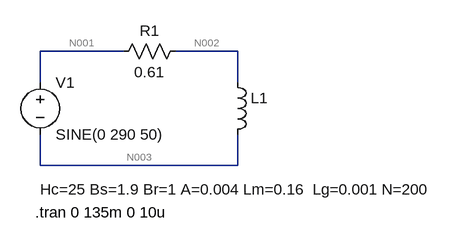
[diagram p0: schematic Inductor with a magnetic core.asc]
Inductor with a magnetic core.asc, the LTspice schematic file:
Version 4.1
SHEET 1 880 680
WIRE 224 16 96 16
WIRE 400 16 304 16
WIRE 96 64 96 16
WIRE 400 64 400 16
WIRE 96 192 96 144
WIRE 400 192 400 144
WIRE 400 192 96 192
SYMBOL voltage 96 48 R0
WINDOW 123 0 0 Left 0
WINDOW 39 0 0 Left 0
SYMATTR InstName V1
SYMATTR Value SINE(0 290 50)
SYMBOL res 320 0 R90
WINDOW 0 0 56 VBottom 2
WINDOW 3 32 56 VTop 2
SYMATTR InstName R1
SYMATTR Value 0.61
SYMBOL ind 384 48 R0
WINDOW 3 -288 181 Left 2
SYMATTR Value Hc=25 Bs=1.9 Br=1 A=0.004 Lm=0.16  Lg=0.001 N=200
SYMATTR InstName L1
SYMATTR SpiceLine Rser=1m
TEXT 88 264 Left 2 !.tran 0 135m 0 10u

The netlist it stands for:
* Inductor with a magnetic core.asc
V1 N001 N003 SINE(0 290 50)
R1 N002 N001 0.61
L1 N002 N003 Hc=25 Bs=1.9 Br=1 A=0.004 Lm=0.16  Lg=0.001 N=200 Rser=1m
.tran 0 135m 0 10u
.backanno
.end

* Results of the author's LTspice run, read from the files saved beside the schematic
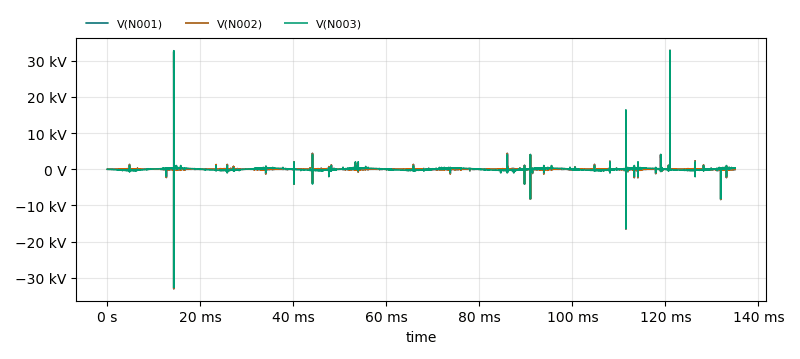
[diagram p1: Transient Analysis of Inductor with a magnetic core.asc, plotted from the saved traces]
* Transient Analysis, 1 run:
*   V(N001): min -33.05 kV, max 32.86 kV, average 1.698 V, rms 47.32 V, last -34 V
*   V(N002): min -33.05 kV, max 32.86 kV, average -1.884 V, rms 46.04 V, last -35.32 V
*   V(N003): min -32.77 kV, max 32.77 kV, average -5.14 V, rms 210.5 V, last 256 V